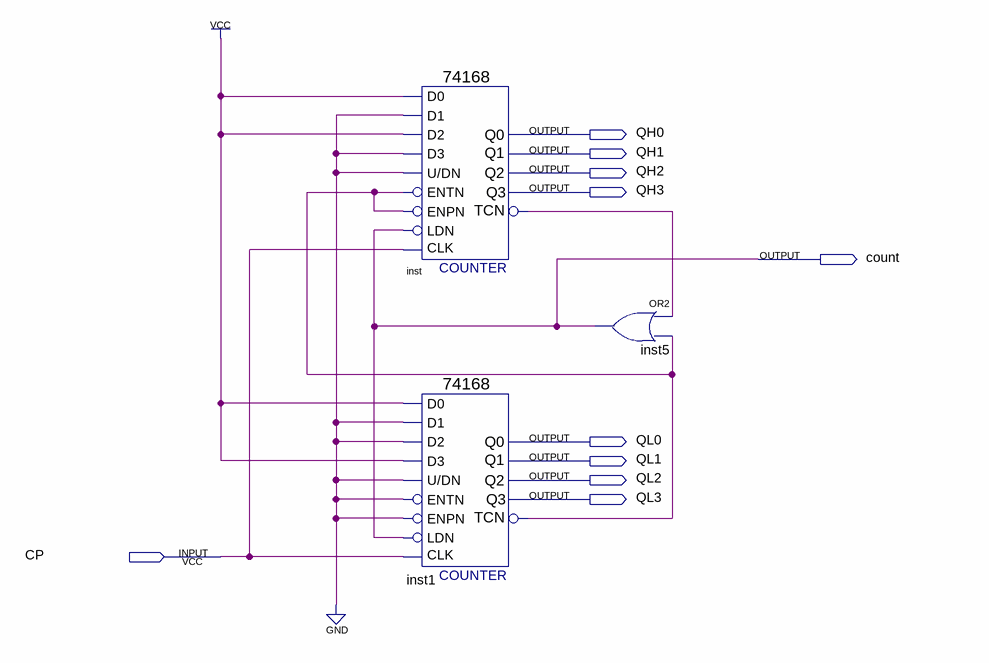
[diagram p0: schematic sheet]
// Quartus schematic M60.bdf as structural Verilog: 3 symbols, 10 pins
module M60 (
  input  CP,
  output QH0,
  output QH1,
  output QH2,
  output QH3,
  output count,
  output QL0,
  output QL1,
  output QL2,
  output QL3
);

  wire inst1_tcn, inst_tcn;

  \74168  inst (
    .D0(1'b1), .D1(1'b0), .D2(1'b1), .D3(1'b0), .\U/DN (1'b0), .ENPN(inst1_tcn), .CLK(CP), .ENTN(inst1_tcn),
    .LDN(count), .Q3(QH3), .TCN(inst_tcn), .Q1(QH1), .Q0(QH0), .Q2(QH2));
  \74168  inst1 (
    .D0(1'b1), .D1(1'b0), .D2(1'b0), .D3(1'b1), .\U/DN (1'b0), .ENPN(1'b0), .CLK(CP), .ENTN(1'b0),
    .LDN(count), .Q3(QL3), .TCN(inst1_tcn), .Q1(QL1), .Q0(QL0), .Q2(QL2));
  or inst5 (count, inst_tcn, inst1_tcn);
endmodule
